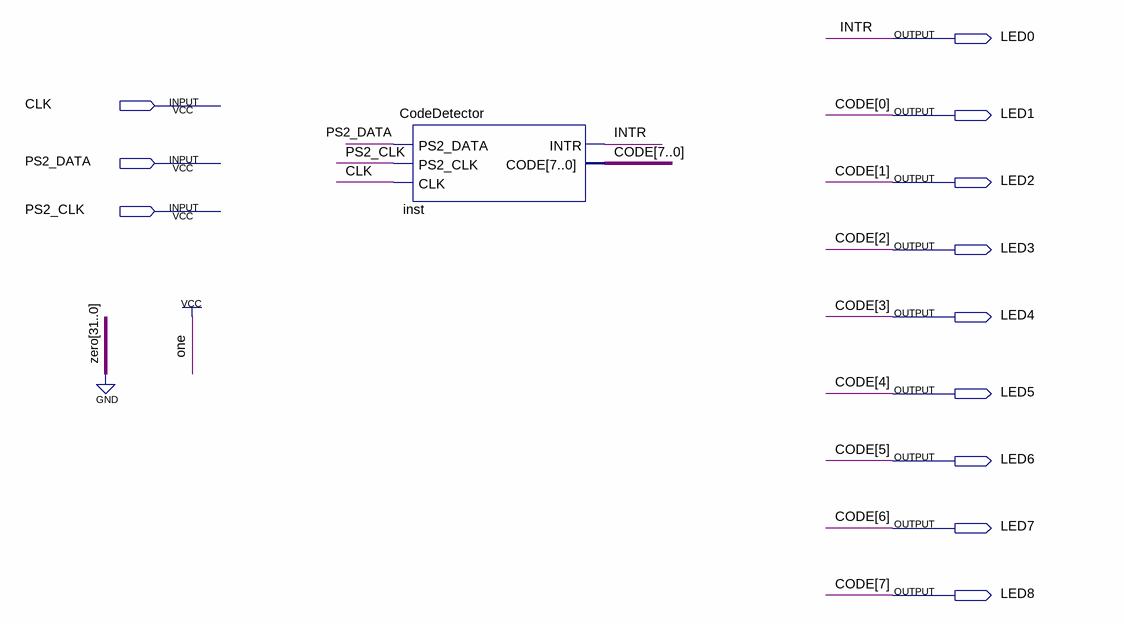
[diagram p0: schematic sheet]
// Quartus schematic TESTTT.bdf as structural Verilog: 1 symbols, 12 pins
module TESTTT (
  input  CLK,
  input  PS2_DATA,
  input  PS2_CLK,
  output LED0,
  output LED1,
  output LED2,
  output LED3,
  output LED4,
  output LED5,
  output LED6,
  output LED7,
  output LED8
);

  CodeDetector inst (
    .PS2_DATA(PS2_DATA), .PS2_CLK(PS2_CLK), .CLK(CLK), .INTR(LED0),
    .CODE({LED8, LED7, LED6, LED5, LED4, LED3, LED2, LED1}));

  // Other names for the same wires on the sheet: CODE[7:0] = {LED8, LED7, LED6, LED5, LED4, LED3, LED2, LED1};
  //   INTR = LED0
endmodule
